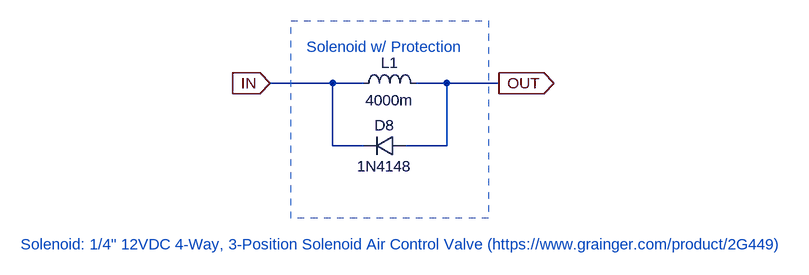
[diagram p0: schematic SolenoidCircuitModel.asc]
SolenoidCircuitModel.asc, the LTspice schematic file:
Version 4
SHEET 1 1112 952
WIRE 128 -416 32 -416
WIRE 176 -416 128 -416
WIRE 304 -416 256 -416
WIRE 384 -416 304 -416
WIRE 128 -320 128 -416
WIRE 176 -320 128 -320
WIRE 304 -320 304 -416
WIRE 304 -320 240 -320
FLAG 32 -416 IN
IOPIN 32 -416 In
FLAG 384 -416 OUT
IOPIN 384 -416 Out
SYMBOL ind 160 -400 R270
WINDOW 0 32 56 VTop 2
WINDOW 3 5 56 VBottom 2
SYMATTR InstName L1
SYMATTR Value 4000m
SYMATTR SpiceLine Ipk=0.5 Rser=25 Rpar=100 Cpar=0.1u
SYMBOL diode 240 -336 R90
WINDOW 0 0 32 VBottom 2
WINDOW 3 32 32 VTop 2
SYMATTR InstName D8
SYMATTR Value 1N4148
TEXT -352 -168 Left 2 ;Solenoid: 1/4" 12VDC 4-Way, 3-Position Solenoid Air Control Valve (https://www.grainger.com/product/2G449)
TEXT 88 -472 Left 2 ;Solenoid w/ Protection
RECTANGLE Normal 368 -208 64 -512 2

The netlist it stands for:
* SolenoidCircuitModel.asc
L1 IN OUT 4000m Ipk=0.5 Rser=25 Rpar=100 Cpar=0.1u
D8 OUT IN 1N4148
.model D D
.lib standard.dio
* Solenoid: 1/4" 12VDC 4-Way, 3-Position Solenoid Air Control Valve (https://www.grainger.com/product/2G449)
* Solenoid w/ Protection
.backanno
.end